# Altium project PCB_Project.PrjPcb
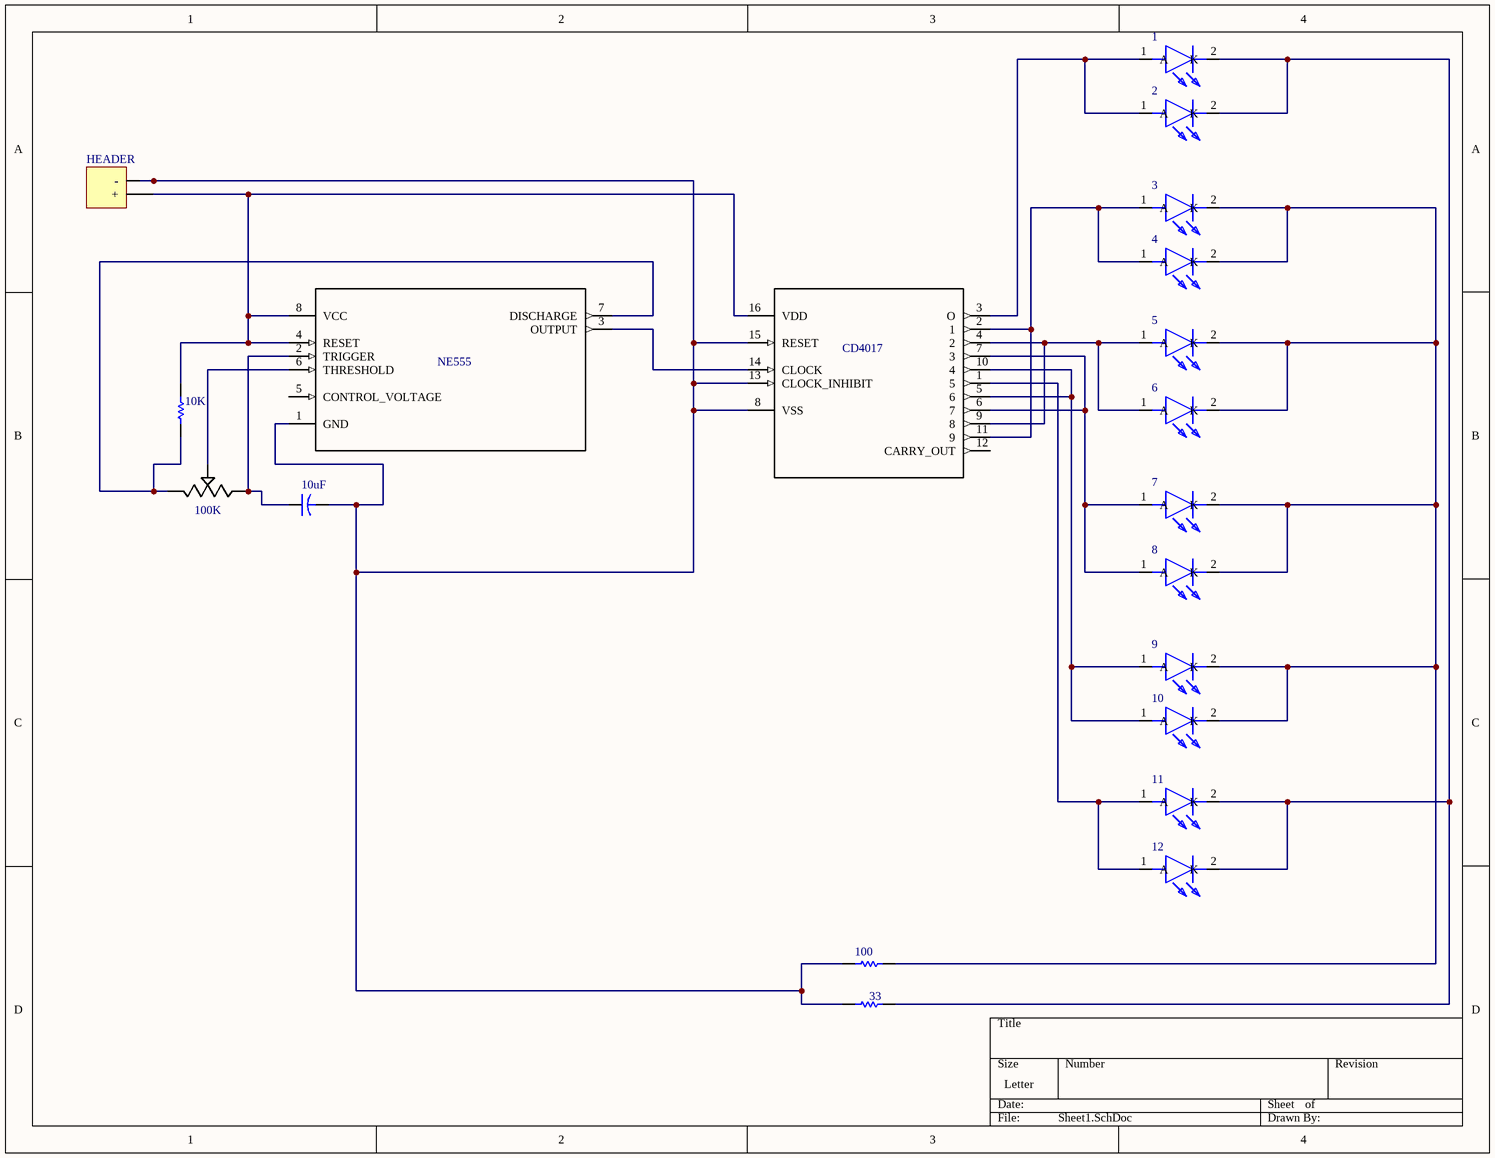
[diagram p0: Sheet1.SchDoc]
1 sheet, 20 parts. Net scope: global (net labels, ports and power ports of the same name join across sheets).
Board file: PCB1.PcbDoc

## Sheet Sheet1.SchDoc
size Letter

### Parts
1  L-53GD  [L-53GD]  (value not drawn)
2  L-53GD  [L-53GD]  (value not drawn)
3  L-53GD  [L-53GD]  (value not drawn)
4  L-53GD  [L-53GD]  (value not drawn)
5  L-53GD  [L-53GD]  (value not drawn)
6  L-53GD  [L-53GD]  (value not drawn)
7  L-53GD  [L-53GD]  (value not drawn)
8  L-53GD  [L-53GD]  (value not drawn)
9  L-53GD  [L-53GD]  (value not drawn)
10  L-53GD  [L-53GD]  (value not drawn)
10K  Res1  [AXIAL-0.3]  (value not drawn)
10uF  Cap2  [CAPR5-4X5]  (value not drawn)
11  L-53GD  [L-53GD]  (value not drawn)
12  L-53GD  [L-53GD]  (value not drawn)
33  Res1  [AXIAL-0.3]  (value not drawn)
100  Res1  [AXIAL-0.3]  (value not drawn)
100K  EVN-D8AA03B14  [*TRIM_EVN-D8AA03B14]  (value not drawn)
CD4017  CD4017BE  [*DIP254P762X508-16]  (value not drawn)
HEADER  Header 2  [HDR1X2]  (value not drawn)
NE555  NE555N  [*DIP254P762X533-8]  (value not drawn)

### Nets
Net1_1: 1.1(A) 2.1(A) CD4017.3(O)
Net1_2: 1.2(K) 2.2(K) 11.2(K) 12.2(K) 33.2
Net3_1: 3.1(A) 4.1(A) CD4017.2(1) CD4017.11(9)
Net3_2: 3.2(K) 4.2(K) 5.2(K) 6.2(K) 7.2(K) 8.2(K) 9.2(K) 10.2(K) 100.2
Net5_1: 5.1(A) 6.1(A) CD4017.4(2) CD4017.9(8)
Net7_1: 7.1(A) 8.1(A) CD4017.6(7) CD4017.7(3)
Net9_1: 9.1(A) 10.1(A) CD4017.5(6) CD4017.10(4)
Net10K_1: 10K.1 100K.3 NE555.7(DISCHARGE)
Net10K_2: 10K.2 CD4017.16(VDD) HEADER.1(+) NE555.4(RESET) NE555.8(VCC)
Net10uF_1: 10uF.1 100K.1 NE555.2(TRIGGER)
Net10uF_2: 10uF.2 33.1 100.1 CD4017.8(VSS) CD4017.13(CLOCK_INHIBIT) CD4017.15(RESET) HEADER.2(-) NE555.1(GND)
Net11_1: 11.1(A) 12.1(A) CD4017.1(5)
Net100K_2: 100K.2 NE555.6(THRESHOLD)
NetCD4017_14: CD4017.14(CLOCK) NE555.3(OUTPUT)

Not connected (* = marked no-connect by the designer): CD4017 12(CARRY_OUT); NE555 5(CONTROL_VOLTAGE)

### Library data of the parts
1-12 = L-53GD: LED; Manufacturer_Name: Kingbright; Allied_Number: 70424261; Datasheet Link: http://docs-emea.rs-online.com/webdocs/151e/0900766b8151e408.pdf; Manufacturer_Part_Number: L-53GD; Mouser Part Number: N/A; Mouser Price/Stock: https://www.mouser.com/Search/Refine.aspx?Keyword=N%2FA; RS Part Number: 2286004A; RS Price/Stock: http://uk.rs-online.com/web/p/products/2286004A; Allied Price/Stock: http://www.alliedelec.com/kingbright-l-53gd/70424261/
10K 33 100 = Res1: Resistor; Value: 1K; Published: 8-Jun-2000; LatestRevisionDate: 17-Jul-2002; LatestRevisionNote: Re-released for DXP Platform.; PackageReference: AXIAL-0.3; Publisher: Altium Limited; PackageDescription: Axial Device, Thru-Hole; 2 Leads; 0.3 in Pin Spacing
10uF = Cap2: Capacitor; Value: 10uF; Published: 23-Sep-2002; PackageReference: CAPR5-4X5; Publisher: Altium Limited; PackageDescription: Capacitor; 2 Leads
100K = EVN-D8AA03B14: Trimmer; Carbon; Rest 10 Kilohms; PCB; 1 Turn; Pwr-Rtg 0.1 W; Linear; Top Adj; 6 mm SQ; MF: Panasonic Electronic; Availability: Unavailable; Price: None; SnapEDA_Link: https://www.snapeda.com/parts/EVN-D8AA03B14/Panasonic%20Electronic%20Components/view-part/?ref=snap; MP: EVN-D8AA03B14; Package: PQFP-44 Panasonic; Value: *
CD4017 = CD4017BE: IC Mos 4017/CD4017BE HARRIS; MF: Texas; SnapEDA_Link: https://www.snapeda.com/parts/CD4017BE/Texas%20Instruments/view-part/?ref=snap; Availability: Unavailable; Price: None; MP: CD4017BE; Package: DIP-16 Intersil; Value: *
HEADER = Header 2: Header, 2-Pin; LatestRevisionDate: 17-Jul-2002; LatestRevisionNote: Re-released for DXP Platform.; Publisher: Altium Limited
NE555 = NE555N: MF: ON Semiconductor; Price: None; SnapEDA_Link: https://www.snapeda.com/parts/NE555N/ON%20Semiconductor/view-part/?ref=snap; Availability: Unavailable; MP: NE555N; Package: DIP-8 Texas Instruments; Value: *